# Altium schematic sheet cover.SchDoc
size A4; Organization: GPA & FRYK Industries; DocumentNumber: 1; Revision: REV 0; SheetNumber: 1; SheetTotal: 6
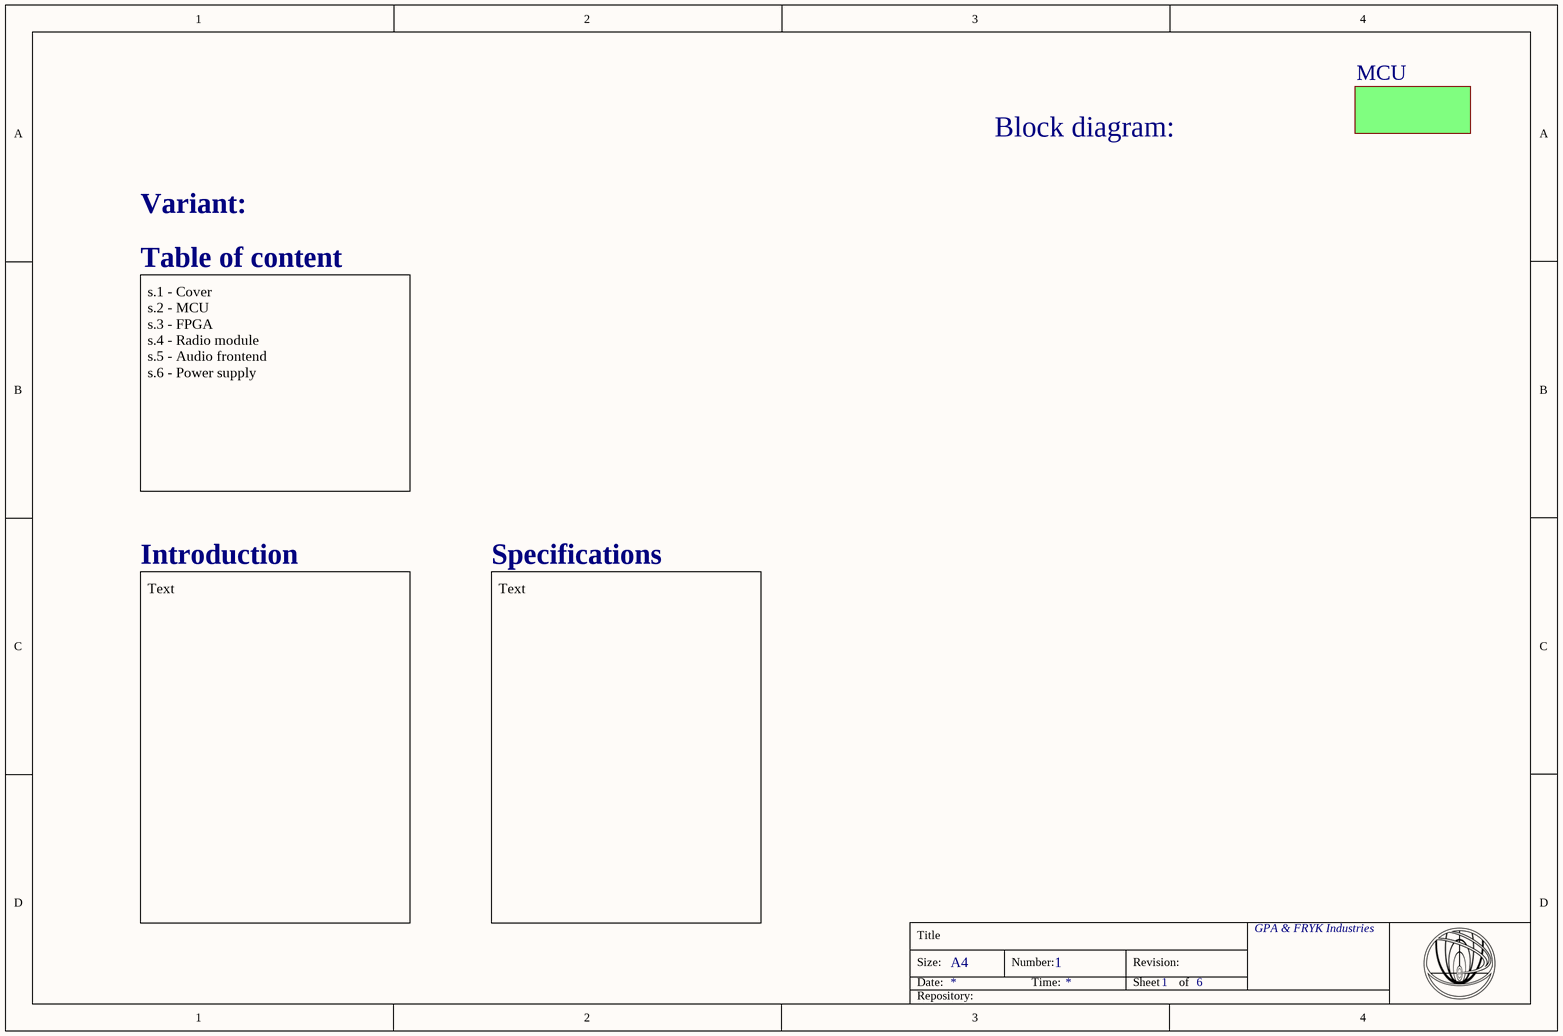
[diagram p0: cover.SchDoc]

## Sub-sheets
MCU = mcu.SchDoc: no entries

## Notes on the sheet
- Block diagram:
- Table of content
- s.1 - Cover
  s.2 - MCU
  s.3 - FPGA
  s.4 - Radio module
  s.5 - Audio frontend
  s.6 - Power supply
- Introduction
- Specifications
- Text
- Variant:
- Title
- Size:
- Date:
- A4
- Number:
- Time:
- Revision:
- Sheet
- of
- Repository: